# EAGLE schematic shield (EAGLE 6.4)
Boomerang shield
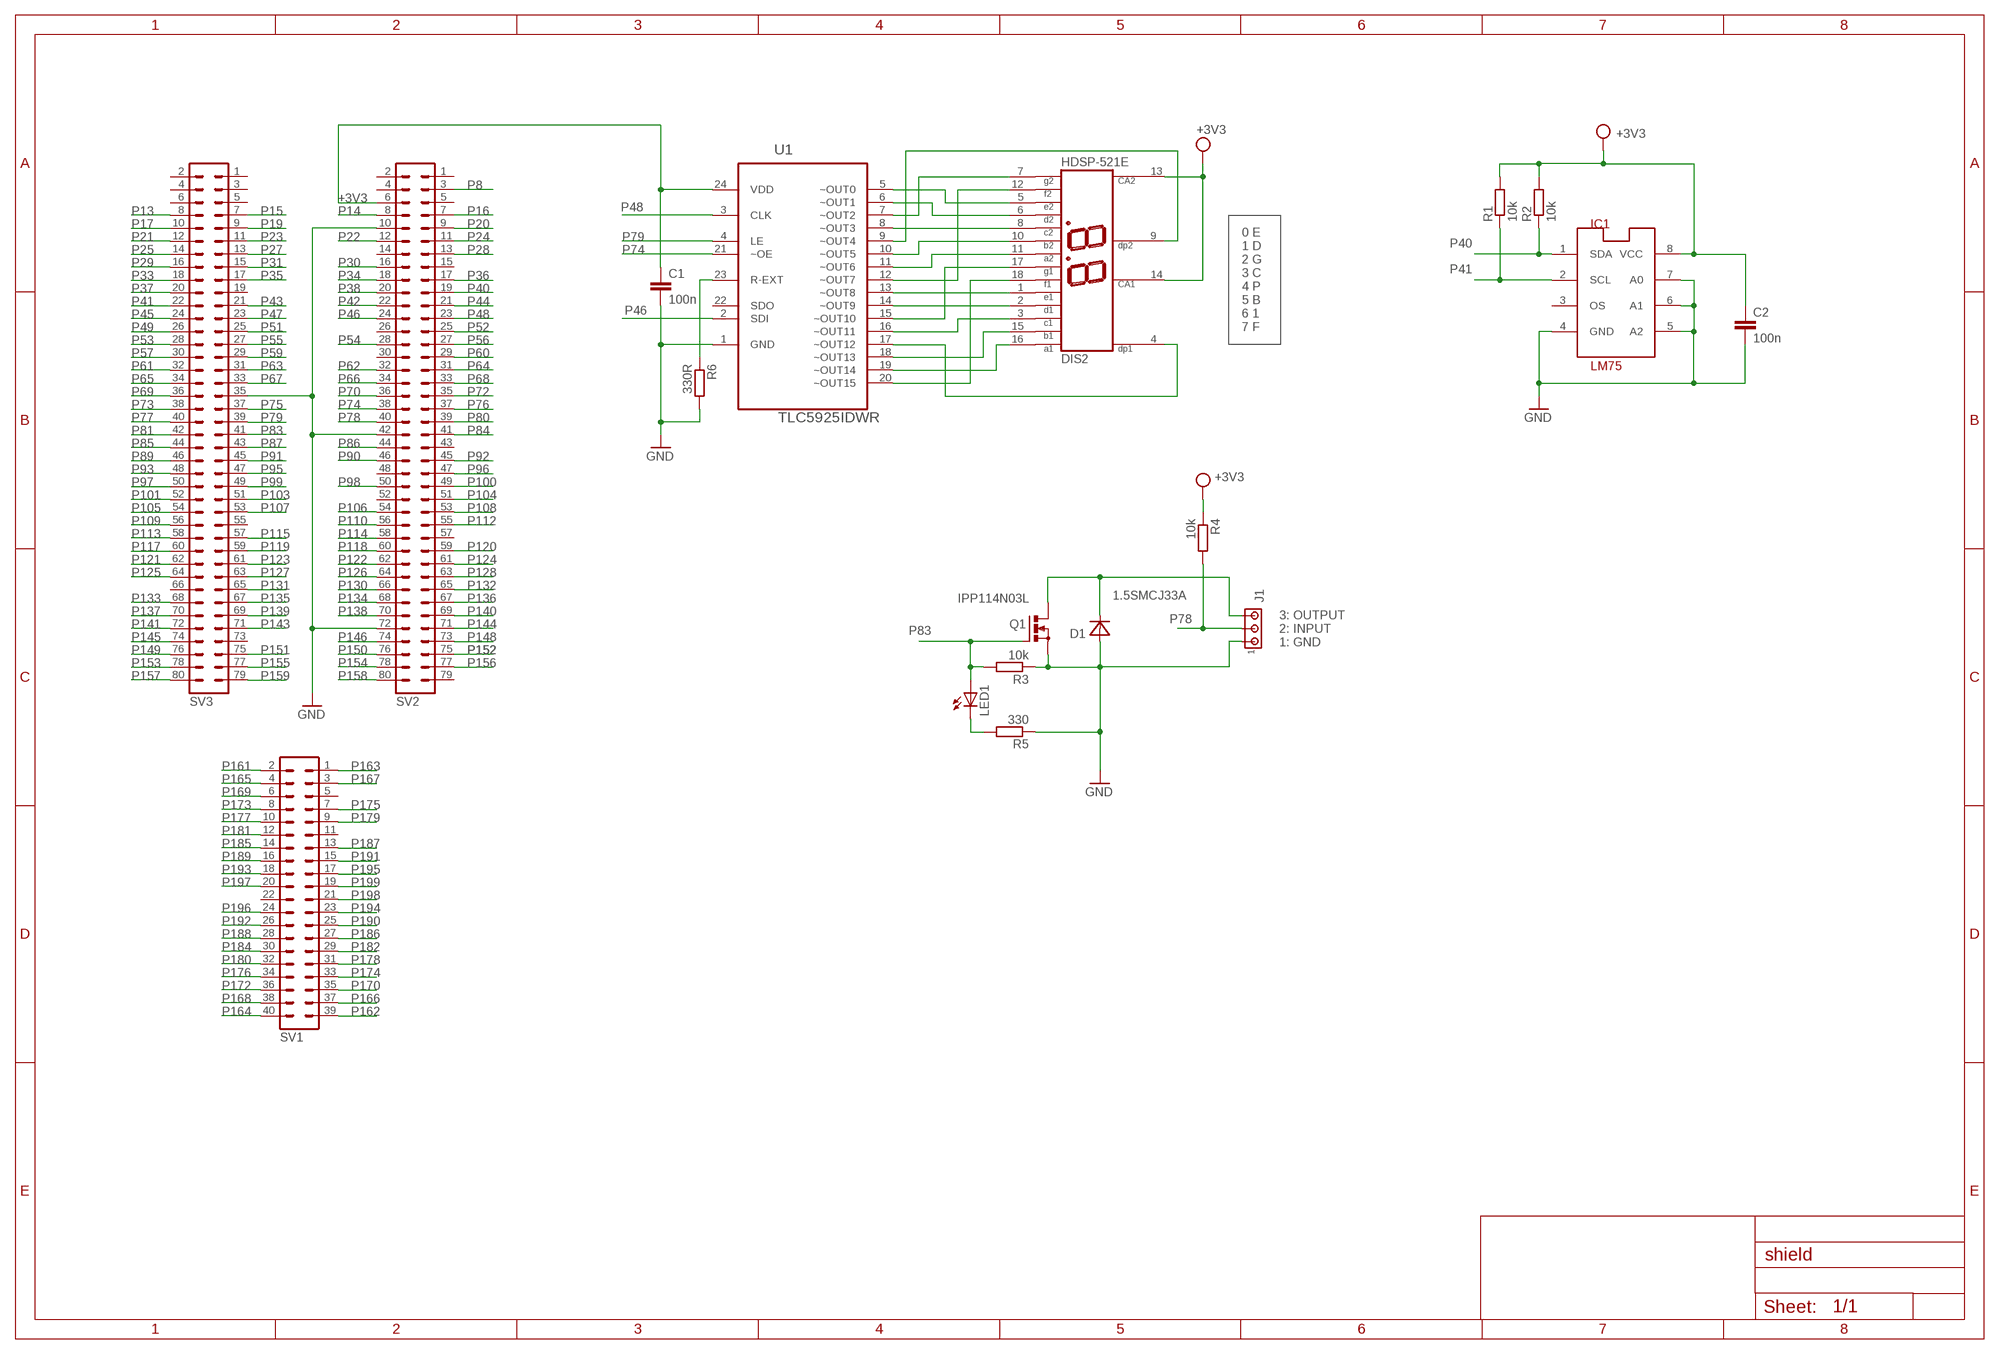
[diagram p0: schematic, sheet 1]

## Parts
C1  100n  C2.5/2  [C2.5-2]
C2  100n  C2.5/2  [C2.5-2]
D1  1.5SMCJ33A  MBRS340  [DO214AB]
DIS2  HDSP-521E  HD-K121  [HDSP-R]
IC1  LM75  LM75_ICN  [SO8_LM75]
J1  MTA03-100  [10X03MTA]
LED1  LED5MM  [LED5MM]
Q1  IPP114N03L  BUZ11BV  [TO220BV]
R1  10k  R-EU_0207/10  [0207/10]
R2  10k  R-EU_0207/10  [0207/10]
R3  10k  R-EU_0207/10  [0207/10]
R4  10k  R-EU_0207/10  [0207/10]
R5  330  R-EU_0207/10  [0207/10]
R6  330R  R-EU_0207/10  [0207/10]
SV1  MA20-2  [MA20-2]
SV2  MA40-2  [MA40-2]
SV3  MA40-2  [MA40-2]
U1  TLC5925IDWR  [SOIC127P1030X265-24N]

## Nets
+3V3: C1.1 C2.1 DIS2.13(CA2) DIS2.14(CA1) IC1.8(VCC) R1.2 R2.2 R4.1 SV2.6 U1.24(VDD) ; supply symbol labelled VDD
GND: C1.2 C2.2 D1.A IC1.4(GND) IC1.5(A2) IC1.6(A1) IC1.7(A0) J1.1 Q1.S R3.1 R5.1 R6.2 SV2.10 SV2.42 SV2.72 SV3.35 U1.1(GND)
N$1: DIS2.5(E2) U1.5(~OUT0)
N$2: DIS2.6(D2) U1.6(~OUT1)
N$3: DIS2.7(G2) U1.7(~OUT2)
N$4: DIS2.8(C2) U1.8(~OUT3)
N$5: DIS2.9(DP2) U1.9(~OUT4)
N$6: DIS2.10(B2) U1.10(~OUT5)
N$7: DIS2.11(A2) U1.11(~OUT6)
N$8: DIS2.12(F2) U1.12(~OUT7)
N$9: DIS2.1(E1) U1.13(~OUT8)
N$10: DIS2.2(D1) U1.14(~OUT9)
N$11: DIS2.17(G1) U1.15(~OUT10)
N$12: DIS2.3(C1) U1.16(~OUT11)
N$13: DIS2.4(DP1) U1.17(~OUT12)
N$14: DIS2.15(B1) U1.18(~OUT13)
N$15: DIS2.16(A1) U1.19(~OUT14)
N$16: DIS2.18(F1) U1.20(~OUT15)
N$17: D1.K(C) J1.3 Q1.D
N$18: LED1.K(C) R5.2
N$20: R6.1 U1.23(R-EXT)
P8: SV2.3
P13: SV3.8
P14: SV2.8
P15: SV3.7
P16: SV2.7
P17: SV3.10
P19: SV3.9
P20: SV2.9
P21: SV3.12
P22: SV2.12
P23: SV3.11
P24: SV2.11
P25: SV3.14
P27: SV3.13
P28: SV2.13
P29: SV3.16
P30: SV2.16
P31: SV3.15
P33: SV3.18
P34: SV2.18
P35: SV3.17
P36: SV2.17
P37: SV3.20
P38: SV2.20
P40: IC1.1(SDA) R2.1 SV2.19
P41: IC1.2(SCL) R1.1 SV3.22
P42: SV2.22
P43: SV3.21
P44: SV2.21
P45: SV3.24
P46: SV2.24 U1.2(SDI)
P47: SV3.23
P48: SV2.23 U1.3(CLK)
P49: SV3.26
P51: SV3.25
P52: SV2.25
P53: SV3.28
P54: SV2.28
P55: SV3.27
P56: SV2.27
P57: SV3.30
P59: SV3.29
P60: SV2.29
P61: SV3.32
P62: SV2.32
P63: SV3.31
P64: SV2.31
P65: SV3.34
P66: SV2.34
P67: SV3.33
P68: SV2.33
P69: SV3.36
P70: SV2.36
P72: SV2.35
P73: SV3.38
P74: SV2.38 U1.21(~OE)
P75: SV3.37
P76: SV2.37
P77: SV3.40
P78: J1.2 R4.2 SV2.40
P79: SV3.39 U1.4(LE)
P80: SV2.39
P81: SV3.42
P83: LED1.A Q1.G R3.2 SV3.41
P84: SV2.41
P85: SV3.44
P86: SV2.44
P87: SV3.43
P89: SV3.46
P90: SV2.46
P91: SV3.45
P92: SV2.45
P93: SV3.48
P95: SV3.47
P96: SV2.47
P97: SV3.50
P98: SV2.50
P99: SV3.49
P100: SV2.49
P101: SV3.52
P103: SV3.51
P104: SV2.51
P105: SV3.54
P106: SV2.54
P107: SV3.53
P108: SV2.53
P109: SV3.56
P110: SV2.56
P112: SV2.55
P113: SV3.58
P114: SV2.58
P115: SV3.57
P117: SV3.60
P118: SV2.60
P119: SV3.59
P120: SV2.59
P121: SV3.62
P122: SV2.62
P123: SV3.61
P124: SV2.61
P125: SV3.64
P126: SV2.64
P127: SV3.63
P128: SV2.63
P130: SV2.66
P131: SV3.65
P132: SV2.65
P133: SV3.68
P134: SV2.68
P135: SV3.67
P136: SV2.67
P137: SV3.70
P138: SV2.70
P139: SV3.69
P140: SV2.69
P141: SV3.72
P143: SV3.71
P144: SV2.71
P145: SV3.74
P146: SV2.74
P148: SV2.73
P149: SV3.76
P150: SV2.76
P151: SV3.75
P152: SV2.75
P153: SV3.78
P154: SV2.78
P155: SV3.77
P156: SV2.77
P157: SV3.80
P158: SV2.80
P159: SV3.79
P161: SV1.2
P162: SV1.39
P163: SV1.1
P164: SV1.40
P165: SV1.4
P166: SV1.37
P167: SV1.3
P168: SV1.38
P169: SV1.6
P170: SV1.35
P172: SV1.36
P173: SV1.8
P174: SV1.33
P175: SV1.7
P176: SV1.34
P177: SV1.10
P178: SV1.31
P179: SV1.9
P180: SV1.32
P181: SV1.12
P182: SV1.29
P184: SV1.30
P185: SV1.14
P186: SV1.27
P187: SV1.13
P188: SV1.28
P189: SV1.16
P190: SV1.25
P191: SV1.15
P192: SV1.26
P193: SV1.18
P194: SV1.23
P195: SV1.17
P196: SV1.24
P197: SV1.20
P198: SV1.21
P199: SV1.19
Unconnected: IC1.3(OS) SV1.5 SV1.11 SV1.22 SV2.1 SV2.2 SV2.4 SV2.5 SV2.14 SV2.15 SV2.26 SV2.30 SV2.43 SV2.48 SV2.52 SV2.57 SV2.79 SV3.1 SV3.2 SV3.3 SV3.4 SV3.5 SV3.6 SV3.19 SV3.55 SV3.66 SV3.73 U1.22(SDO)

## Notes on the sheet
- 0 E
  1 D
  2 G
  3 C
  4 P
  5 B
  6 1
  7 F
- 3: OUTPUT
  2: INPUT
  1: GND

## Library data of the parts
C1 C2 = capacitor-wima:C: CAPACITOR naming: grid - package width
D1 = seb:MBRS340
DIS2 = display-hp:HD-K121: LED DISPLAY 2 x 1 character 7 segment, decimal points right; OC_FARNELL: unknown; OC_NEWARK: unknown
IC1 = lm75:LM75_IC: Temperatursensor
J1 = con-amp:MTA03-100: AMP connector
LED1 = led:LED: LED OSRAM: - CHIPLED LG R971, LG N971, LY N971, LG Q971, LY Q971, LO R971, LY R971 LH N974, LH R974 LS Q976, LO Q976, LY Q976 LO Q996 - Hyper CHIPLED LW Q18S LB Q993, LB Q99A, LB R99A - SideLED LS A670, LO A670, LY A670, LG A670, LP A670 LB A673, LV A673, LT A673, LW A673 LH A674 LY A675 LS A676, LA A676, LO A676, LY A676, LW A676 LS A679, LY A679, LG A679 - Hyper Micro SIDELED® LS Y876, LA Y876, LO Y876, LY Y876 LT Y87S - SmartLED LW L88C, LW L88S LB L89C, LB L89S, LG L890 LS L89K, LO L89K, LY L89K LS L896, LA L896, LO L896, LY L896 - TOPLED LS T670, LO T670, LY T670, LG T670, LP T670 LSG T670, LSP T670, LSY T670, LOP T670, LYG T670 LG T671, LOG T671, LSG T671 LB T673, LV T673, LT T673, LW T673 LH T674 LS T676, LA T676, LO T676, LY T676, LB T676, LH T676, LSB T676, LW T676 LB T67C, LV T67C, LT T67C, LS T67K, LO T67K, LY T67K, LW E67C LS E67B, LA E67B, LO E67B, LY E67B, LB E67C, LV E67C, LT E67C LW T67C LS T679, LY T679, LG T679 LS T770, LO T770, LY T770, LG T770, LP T770 LB T773, LV T773, LT T773, LW T773 LH T774 LS E675, LA E675, LY E675, LS T675 LS T776, LA T776, LO T776, LY T776, LB T776 LHGB T686 LT T68C, LB T68C - Hyper Mini TOPLED® LB M676 - Mini TOPLED Santana® LG M470 LS M47K, LO M47K, LY M47K Source: http://www.osram.convergy.de LUXEON: - LUMILED® LXK2-PW12-R00, LXK2-PW12-S00, LXK2-PW14-U00, LXK2-PW14-V00 LXK2-PM12-R00, LXK2-PM12-S00, LXK2-PM14-U00 LXK2-PE12-Q00, LXK2-PE12-R00, LXK2-PE12-S00, LXK2-PE14-T00, LXK2-PE14-U00 LXK2-PB12-K00, LXK2-PB12-L00, LXK2-PB12-M00, LXK2-PB14-N00, LXK2-PB14-P00, LXK2-PB14-Q00 LXK2-PR12-L00, LXK2-PR12-M00, LXK2-PR14-Q00, LXK2-PR14-R00 LXK2-PD12-Q00, LXK2-PD12-R00, LXK2-PD12-S00 LXK2-PH12-R00, LXK2-PH12-S00 LXK2-PL12-P00, LXK2-PL12-Q00, LXK2-PL12-R00 Source: www.luxeon.com KINGBRIGHT: KA-3528ASYC Source: www.kingbright.com
Q1 = transistor-power:BUZ11: N-CHANNEL MOS FET
R1-R6 = rcl:R-EU_: RESISTOR, European symbol
SV1 = boomerang:MA20-2: PIN HEADER; OC_FARNELL: unknown; OC_NEWARK: unknown
SV2 SV3 = boomerang:MA40-2: PIN HEADER; OC_FARNELL: unknown; OC_NEWARK: unknown
U1 = Texas Instruments_By_element14_Batch_1:TLC5925IDWR: LOW-POWER 16-CHANNEL CONSTANT-CURRENT LED SINK DRIVER; MPN: TLC5925IDWR; OC_FARNELL: 1858096; OC_NEWARK: 10R6961; PACKAGE: SOIC-24; SUPPLIER: Texas Instruments